# Altium schematic sheet Fiber optic_inputs.SchDoc
size A4; Author: Esteban Durán Madrid; CompanyName: Universidad de Santiago de Chile; Address1: Avenida Ecuador Nº 3519; Address2: Estación Central, Santiago; Address3: Chile; DocumentNumber: 3; SheetNumber: 3; SheetTotal: 4
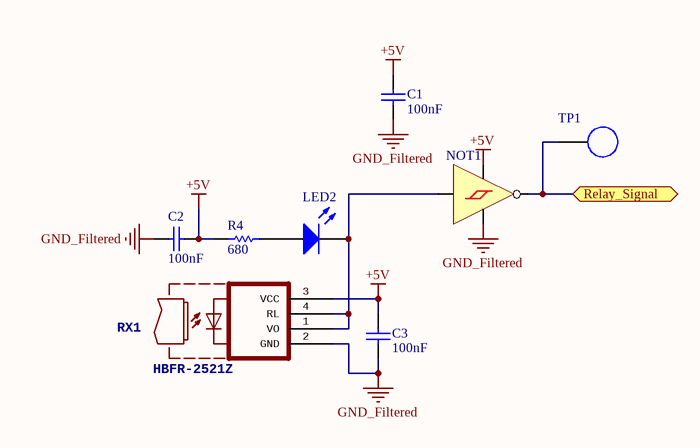
[diagram p0: Fiber optic_inputs.SchDoc]

## Parts
C1  100nF  [CAP_0603]
C2  100nF  [CAP_0603]
C3  100nF  [CAP_0603]
LED2  LED  [LED_0805_GREEN]  (value not drawn)
NOT1  INV_CMOS  [INV_SN74AHC1G14DBVR]  (value not drawn)
R4  680  [RES_0603]
RX1  HBFR-2521Z  [HFBR-15X1V]
TP1  Test Point 0805  [Test Point 0805]  (value not drawn)

## Ports
Relay_Signal (bidir)

## Nets
+5V: C1.1 C2.2 C3.1 NOT1.5(Vcc) R4.1 RX1.3(VCC)
GND_Filtered: C1.2 C2.1 C3.2 NOT1.3(GND) RX1.2(GND)
Relay_Signal: NOT1.4(Vcc) TP1.1(TP) ; port Relay_Signal
NetLED2_1: LED2.1(A) R4.2
NetLED2_2: LED2.2(K) NOT1.2(A) RX1.1(VO) RX1.4(RL)

Not connected (* = marked no-connect by the designer): NOT1 1(NC)

## Notes on the sheet
- Title
- Size:
- Date:
- A4
- Revision:
- Time:
- Sheet
- of
- Author:
- Project:

## Library data of the parts
C1-C3 = Cap: Capacitor; Manufacturer Part-Number: LD03YC104KAB2A; Published: 8-Jun-2000; LatestRevisionDate: 17-Jul-2002; LatestRevisionNote: Re-released for DXP Platform.; PackageReference: RAD-0.3; Publisher: Altium Limited; Value: 100nF; Digikey Part-Number: 478-4929-1-ND
LED2 = LED2: LED Green; Manufacturer Part-Number: LTST-C171GKT; Published: 8-Jun-2000; LatestRevisionDate: 17-Jul-2002; LatestRevisionNote: Re-released for DXP Platform.; PackageDocument: Feb-2002; PackageReference: 3.2X1.6X1.1; Publisher: Altium Limited; Digikey Part-Number: 160-1423-1-ND
NOT1 = INV CMOS: Manufacturer Part-Number: SN74LVC1G14DBVR; Digikey Part-Number: 296-11607-1-ND
R4 = Res0603: Resistor; Manufacturer Part-Number: ESR03EZPJ681; Published: 8-Jun-2000; LatestRevisionDate: 17-Jul-2002; LatestRevisionNote: Re-released for DXP Platform.; PackageReference: AXIAL-0.3; Publisher: Altium Limited; PackageDescription: Axial Device, Thru-Hole; 2 Leads; 0.3 in Pin Spacing; Value: 680; Digikey Part-Number: RHM680DCT-ND
RX1 = HFBR-2521: Receptor optico horizontal; Manufacturer Part-Number: HFBR-2521Z; Digikey Part-Number: 516-2062-ND
TP1 = Test Point 0805: Surface Mount Test Points; Manufacturer Part-Number: RCT-0C; Digikey Part-Number: A106144CT-ND